# Altium schematic sheet WE_Sch.SchDoc
size A4
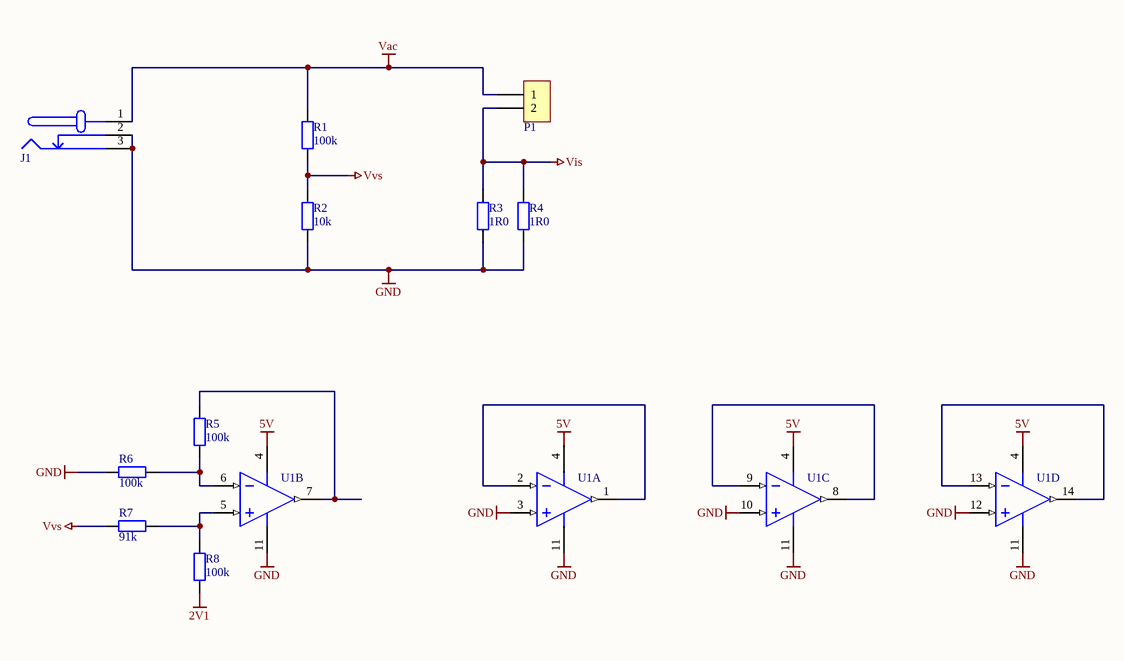
[diagram p0: WE_Sch.SchDoc]

## Parts
J1  DC barrel jack  [AC-Socket]  (value not drawn)
P1  Dual Banana Plugs  [Dual Banana Plug]  (value not drawn)
R1  100k  [AXIAL-0.4]
R2  10k  [AXIAL-0.4]
R3  1R0  [AXIAL-0.4]
R4  1R0  [AXIAL-0.4]
R5  100k  [AXIAL-0.4]
R6  100k  [AXIAL-0.4]
R7  91k  [AXIAL-0.4]
R8  100k  [AXIAL-0.4]
U1  LM324  [DIP-14]  (value not drawn)  (parts A,B,C,D of 4)

## Nets
2V1: R8.1
5V: U1.4(VDD)
GND: J1.2(GND_ALT) J1.3(GND) R2.2 R3.2 R4.2 R6.1 U1.3(VINA+) U1.10(VINC+) U1.11(VSS) U1.12(VIND+)
Vac: J1.1(VCC) P1.1 R1.1
Vis: P1.2 R3.1 R4.1
Vvs: R1.2 R2.1 R7.1
NetR5_1: R5.1 R6.2 U1.6(VINB-)
NetR5_2: R5.2 U1.7(VOUTB)
NetR7_2: R7.2 R8.2 U1.5(VINB+)
NetU1_1: U1.1(VOUTA) U1.2(VINA-)
NetU1_8: U1.8(VOUTC) U1.9(VINC-)
NetU1_13: U1.13(VIND-) U1.14(VOUTD)

## Library data of the parts
J1 = AC_Input: DC barrel jack connection to AC source; Value: socket
P1 = AC_Output: Dual banana plugs connection to the AC load; LatestRevisionDate: 17-Jul-2002; LatestRevisionNote: Re-released for DXP Platform.; Publisher: Altium Limited
R1-R8 = Res_TH_0AX4: Through hole resistor; Published: 8-Jun-2000; LatestRevisionDate: 17-Jul-2002; LatestRevisionNote: Re-released for DXP Platform.; PackageReference: AXIAL-0.4; Publisher: Altium Limited; ComponentLink1Description: http://www.royalohm.com/pdf/product2017/PrecisionMetalMF.pdf
  R1 R5 R6 R8: Value: 100k
  R2: Value: 10k
  R3 R4: Value: 1R0
  R7: Value: 91k
U1 = LM324N_TH_DIP16: IC OPAMP GP 14DIP; Manufacturer: ON Semiconductor; Manufacturer Part Number: LM324N; Amplifier Type: General Purpose; Current - Supply: 1mA; Voltage - Supply, Single/Dual (±): 3 V ~ 32 V, ±1.5 V ~ 16 V; Supplier 1: Digi-Key; RoHS: RoHS Compliant; Category: Integrated Circuits (ICs); Stock 1: 2900; Pricing 1: 1=0.9, 10=0.775, 100=0.5789, 500=0.45482, 1000=0.35145 (NZD); Packaging: Tube; Part Status: Active; Output Type: -; Slew Rate: -; Operating Temperature: 0°C ~ 70°C; Mounting Type: Through Hole; Package / Case: 14-DIP (0.300", 7.62mm); Supplier Device Package: 14-DIP; Base Part Number: LM324; ComponentLink1URL: https://www.fairchildsemi.com/datasheets/LM/LM2902.pdf; ComponentLink1Description: https://www.fairchildsemi.com/datasheets/LM/LM2902.pdf; Supplier Part Number 1: LM324NFS-ND